# Altium schematic sheet Sheet1.SchDoc
size A4
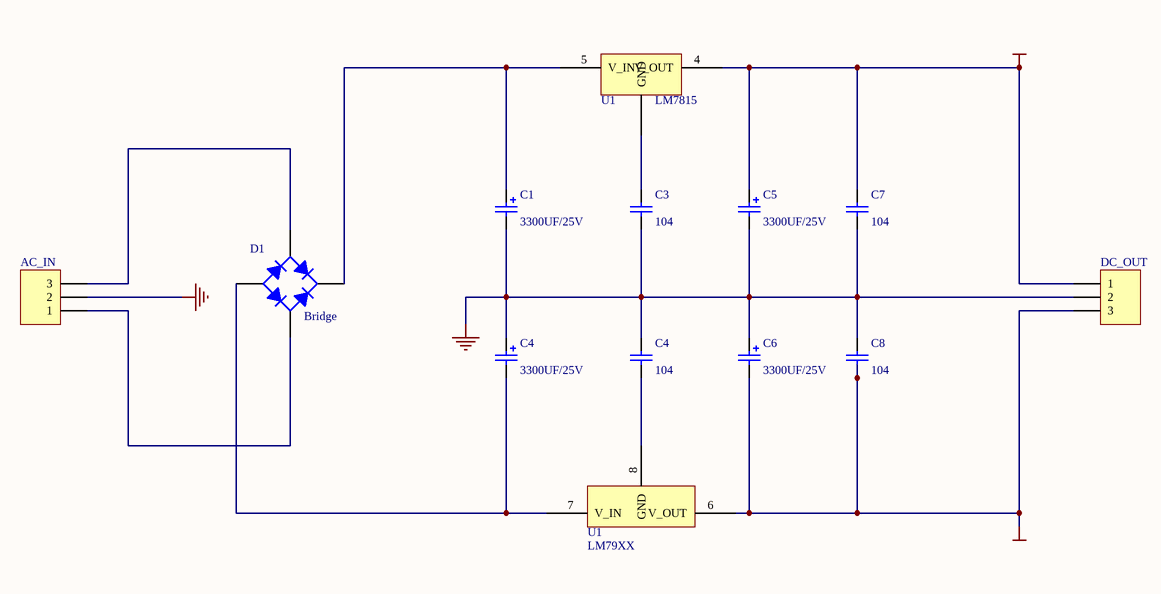
[diagram p0: Sheet1.SchDoc]

## Parts
(Parts that share a designator on the sheet are numbered #1, #2 ... from top to bottom, then left to right.)
AC_IN  Header 3  [HDR1X3]  (value not drawn)
C1  value 3300UF/25V  [POLAR0.8]  (hidden comment: Cap Pol2)
C3  value 104  [RAD-0.3]  (hidden comment: Cap)
C4#1  value 3300UF/25V  [POLAR0.8]  (hidden comment: Cap Pol2)
C4#2  value 104  [RAD-0.3]  (hidden comment: Cap)
C5  value 3300UF/25V  [POLAR0.8]  (hidden comment: Cap Pol2)
C6  value 3300UF/25V  [POLAR0.8]  (hidden comment: Cap Pol2)
C7  value 104  [RAD-0.3]  (hidden comment: Cap)
C8  value 104  [RAD-0.3]  (hidden comment: Cap)
D1  Bridge  [E-BIP-P4/D10]
DC_OUT  Header 3  [HDR1X3]  (value not drawn)
U1#1  LM7815
U1#2  LM79XX

## Nets
+15v: C5.1 C7.2 DC_OUT.1 U1#1.4(V_OUT)
-15v: C6.2 C8.1 DC_OUT.3 U1#2.6(V_OUT)
GND: AC_IN.2 C1.2 C3.1 C4#1.1 C4#2.2 C5.2 C6.1 C7.1 C8.2 DC_OUT.2
NetAC_IN_1: AC_IN.1 D1.4(C)
NetAC_IN_3: AC_IN.3 D1.2(C)
NetC1_1: C1.1 D1.3(K) U1#1.5(V_IN)
NetC3_2: C3.2 U1#1.3(GND)
NetC4#1_2: C4#1.2 D1.1(A) U1#2.7(V_IN)
NetC4#2_1: C4#2.1 U1#2.8(GND)

## Library data of the parts
AC_IN DC_OUT = Header 3: Header, 3-Pin; LatestRevisionDate: 17-Jul-2002; LatestRevisionNote: Re-released for DXP Platform.; Publisher: Altium Limited
C1 C4#1 C5 C6 = Cap Pol2: Polarized Capacitor (Axial); Published: 8-Jun-2000; LatestRevisionDate: 17-Jul-2002; LatestRevisionNote: Re-released for DXP Platform.; Publisher: Altium Limited
C3 C4#2 C7 C8 = Cap: Capacitor; Published: 8-Jun-2000; LatestRevisionDate: 17-Jul-2002; LatestRevisionNote: Re-released for DXP Platform.; Publisher: Altium Limited
D1 = Bridge1: Full Wave Diode Bridge; Published: 8-Jun-2000; LatestRevisionDate: 17-Jul-2002; LatestRevisionNote: Re-released for DXP Platform.; Publisher: Altium Limited
U1#1 = LM78XX